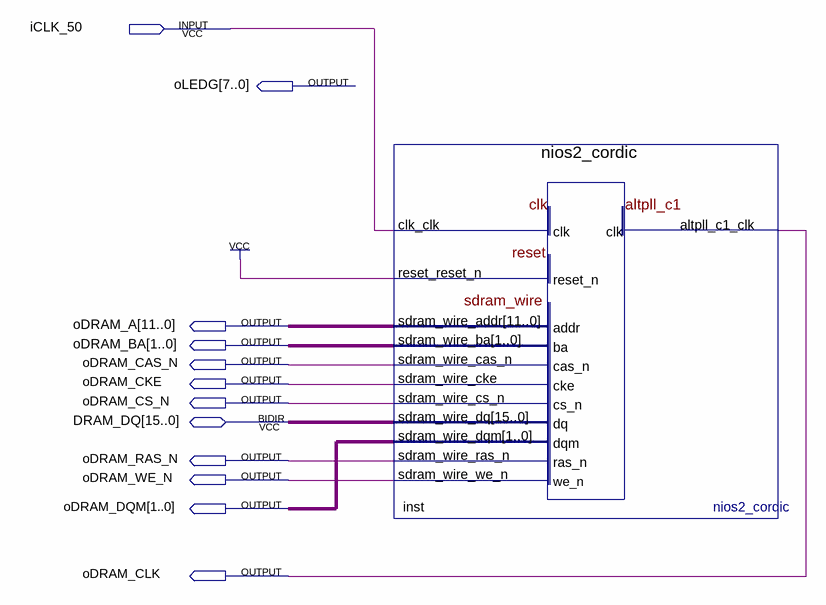
[diagram p0: schematic sheet]
// Quartus schematic hello_world.bdf as structural Verilog: 1 symbols, 12 pins
module hello_world (
  input  iCLK_50,
  inout  [15:0] DRAM_DQ,
  output [7:0] oLEDG,
  output [11:0] oDRAM_A,
  output [1:0] oDRAM_BA,
  output oDRAM_CAS_N,
  output oDRAM_CKE,
  output oDRAM_CS_N,
  output oDRAM_RAS_N,
  output oDRAM_WE_N,
  output [1:0] oDRAM_DQM,
  output oDRAM_CLK
);

  nios2_cordic inst (
    .clk_clk(iCLK_50), .reset_reset_n(1'b1), .sdram_wire_addr(oDRAM_A), .sdram_wire_ba(oDRAM_BA),
    .sdram_wire_cas_n(oDRAM_CAS_N), .sdram_wire_cke(oDRAM_CKE), .sdram_wire_cs_n(oDRAM_CS_N),
    .sdram_wire_dqm(oDRAM_DQM), .sdram_wire_ras_n(oDRAM_RAS_N), .sdram_wire_we_n(oDRAM_WE_N),
    .altpll_c1_clk(oDRAM_CLK), .sdram_wire_dq(DRAM_DQ));
endmodule
